# EAGLE schematic LCMeter-LCD4Bit-18F2550-CMP (EAGLE 7.6.0)
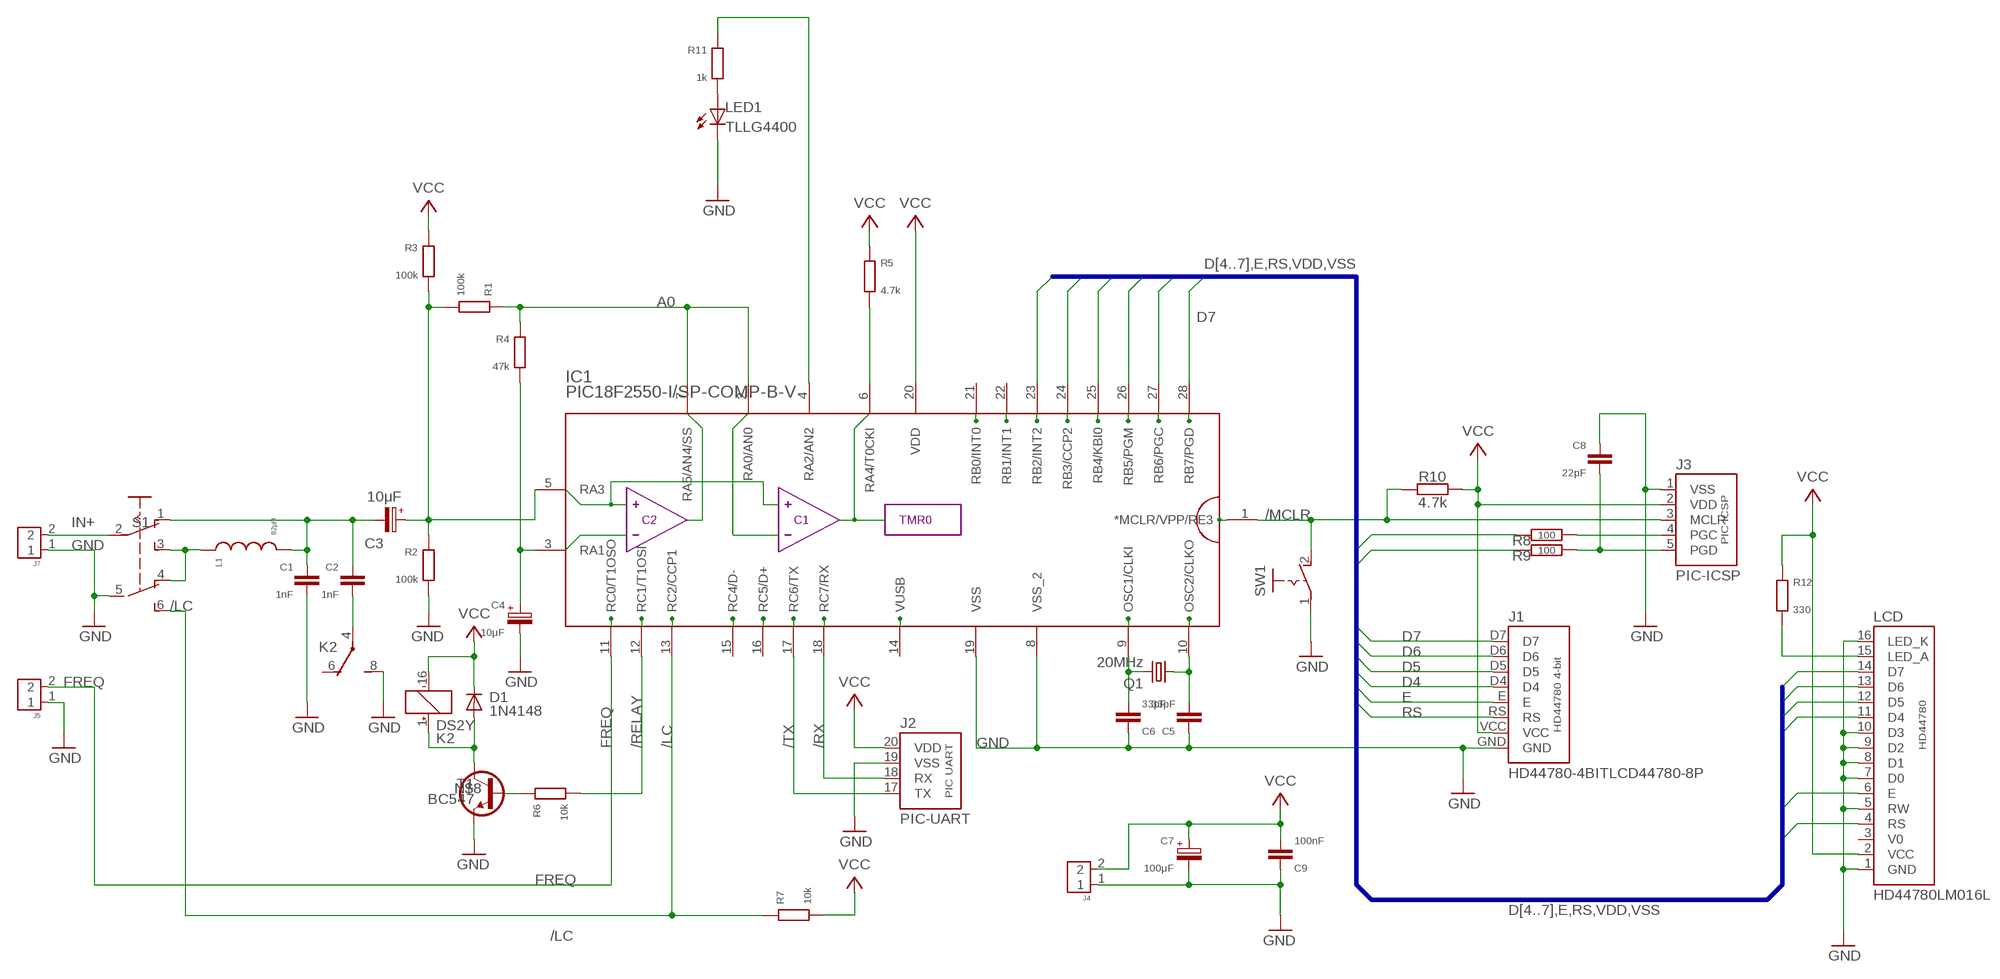
[diagram p0: schematic, sheet 1]

## Parts
C1  1nF  C025-025X060  [C050-025X060]
C2  1nF  C025-025X060  [C050-025X060]
C3  10μF  CPOLE2,5-4  [E2,5-4]
C4  10μF  CPOLE2,5-4  [E2,5-4]
C5  33pF  C025-020X036  [C025-020X036]
C6  33pF  C025-020X036  [C025-020X036]
C7  100μF  CPOLE2.5-5  [E2,5-5]
C8  22pF  C050-020X036  [C050-020X036]
C9  100nF  C025-020X036/V  [C025-020X036/V]
D1  1N4148  1N414834-7  [DO34-7]
IC1  PIC18F2550-I/SP-COMP-B-V  [DIL28-3/V]
J1  HD44780-4BITLCD44780-8P  [CONN-LCD44780]
J2  PIC-UART  [PIC-UART]
J3  PIC-ICSP  PIC-ICSPICSP  [PIC-ICSP]
J4  J4  CONN-2P2P/H  [CONN-2P]
J5  CONN-2P2P/V  [CONN-2P-V]
J7  CONN-2P2P/V  [CONN-2P-V]
K2  DS2Y  DS2Y-S-DC5V  [DS2Y]
L1  82μH  LAXIAL  [0207/10]
LCD  HD44780LM016L  [LM016L-HD44780]
LED1  TLLG4400  [LED3MM]
Q1  20MHz  CRYSTALHC49  [HC49]
R1  100k  R0202/7  [0202/7]
R2  100k  R0202/7  [0202/7]
R3  100k  R0202/7  [0202/7]
R4  47k  R0202/7  [0202/7]
R5  4.7k  R0202/7  [0202/7]
R6  10k  R0202/7-V  [0202/7-V]
R7  10k  R0202/10-V  [0202/10-V]
R8  100  R0202/7-V  [0202/7-V]
R9  100  R0202/5-V  [0202/5-V]
R10  4.7k  R0202/7  [0202/7]
R11  1k  R0202/5-V  [0202/5-V]
R12  330  R0202/7  [0202/7]
S1  SL-SW-2P-2T  [SLSW-2P2T]
SW1  PB-1P-1T  [PB-1P1T]
T1  BC547  BC547CBE-A  [TO92-CBE-A]

## Nets
/LC: IC1.13(RC2/CCP1) R7.2 S1.6(S1)
/MCLR: IC1.1(*MCLR/VPP/RE3) J3.3(MCLR) R10.2 SW1.2(S)
/RELAY: IC1.12(RC1/T1OSI) R6.1
/RX: IC1.18(RC7/RX) J2.18(RX)
/TX: IC1.17(RC6/TX) J2.17(TX)
A0: IC1.2(RA0/AN0) IC1.7(RA5/AN4/SS) R1.2 R4.2
A1: C4.+ IC1.3(RA1) R4.1
A3: C3.+ IC1.5(RA3) R1.1 R2.2 R3.1
A4: IC1.6(RA4/T0CKI) R5.1
C2_CON: C2.2 K2.4(2:P)
D4: IC1.25(RB4/KBI0) J1.D4 LCD.11(D4)
D5: IC1.26(RB5/PGM) J1.D5 LCD.12(D5)
D6: IC1.27(RB6/PGC) J1.D6 LCD.13(D6) R8.2
D7: IC1.28(RB7/PGD) J1.D7 LCD.14(D7) R9.2
E: IC1.24(RB3/CCP2) J1.E LCD.6(E)
FREQ: IC1.11(RC0/T1OSO) J5.2
GND: C1.2 C4.- C5.1 C6.1 C7.- C8.1 C9.1 IC1.8(VSS_2) IC1.19(VSS) J1.GND J2.19(VSS) J3.1(VSS) J4.1 J5.1 J7.1 K2.8(2:S) LCD.1(GND) LCD.5(RW) LCD.7(D0) LCD.8(D1) LCD.9(D2) LCD.10(D3) LCD.16(LED_K) LED1.K(C) R2.1 S1.5(P1) SW1.1(P) T1.E
IN+: J7.2 S1.2(P)
N$1: LED1.A R11.1
N$2: C1.1 C2.1 C3.- L1.2 S1.1(O)
N$3: IC1.4(RA2/AN2) R11.2
N$5: LCD.15(LED_A) R12.1
N$6: R6.2 T1.B
N$7: L1.1 S1.3(S) S1.4(O1)
N$8: D1.A K2.1(1:+) T1.C
OSC1: C6.2 IC1.9(OSC1/CLKI) Q1.2
OSC2: C5.2 IC1.10(OSC2/CLKO) Q1.1
PGC: J3.4(PGC) R8.1
PGD: C8.2 J3.5(PGD) R9.1
RS: IC1.23(RB2/INT2) J1.RS LCD.4(RS)
VCC: C7.+ C9.2 D1.C IC1.20(VDD) J1.VCC J2.20(VDD) J3.2(VDD) J4.2 K2.16(1:-) LCD.2(VCC) R3.2 R5.2 R7.1 R10.1 R12.2
Unconnected: IC1.14(VUSB) IC1.15(RC4/D-) IC1.16(RC5/D+) IC1.21(RB0/INT0) IC1.22(RB1/INT1) K2.6(2:O) K2.9(3:S) K2.11(3:O) K2.13(3:P) LCD.3(V0)

## Buses
D[4..7],E,RS,VDD,VSS

## Library data of the parts
C1 C2 C5 C6 C8 C9 = c:C: CAPACITOR, European symbol
C3 C4 C7 = c:CPOL: POLARIZED CAPACITOR, European symbol
D1 = d:1N4148
IC1 = mcu:PIC18F2550-I/SP-COMP-B
J1 = pinconn:HD44780-4BIT
J2 = pinconn:PIC-UART
J3 = pinconn:PIC-ICSP
J4 J5 J7 = pinconn:CONN-2P
K2 = relay:DS2Y-S-DC*: MINIATURE RELAY NAiS Source: http://www.mew-europe.com/.. en_ds_61005_0023.pdf; MPN: DS2Y-S-DC5V; OC_FARNELL: unknown; OC_NEWARK: 13P3268
L1 = r:L
LCD = lcd:HD44780
LED1 = led:TLLG4400: Low Current (2mA) LED 3 mm Tinted Diffused Package color GREEN Source: Data sheet <http://www.farnell.com/datasheets/391098.pdf>; MF: VISHAY SEMICONDUCTOR; OC_FARNELL: 1612435
Q1 = q:CRYSTAL
R1-R12 = r:R: RESISTOR, European symbol
S1 = sw:SL-SW-2P-2T
SW1 = sw:PB-1P-1T
T1 = t:BC547

## Net classes
0 default: width 0.61 mm